# Altium schematic sheet PORT.SchDoc
size A4; SheetNumber: 5; SheetTotal: 5
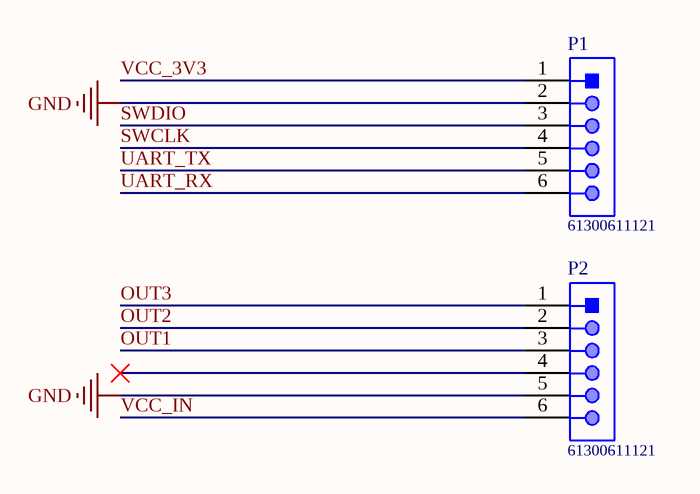
[diagram p0: PORT.SchDoc]

## Parts
P1  61300611121  [61300611121]
P2  61300611121  [61300611121]

## Nets
GND: P1.2 P2.5
OUT1: P2.3
OUT2: P2.2
OUT3: P2.1
SWCLK: P1.4
SWDIO: P1.3
UART_RX: P1.6
UART_TX: P1.5
VCC_3V3: P1.1
VCC_IN: P2.6

Not connected (* = marked no-connect by the designer): P2 4*

## Library data of the parts
P1 P2 = CMP-1502-01070-1: THT Vertical Pin Header WR-PHD, Pitch 2.54 mm, Single Row, 6 pins; Manufacturer: Wurth Elektronik; Gender: Male; Pin Number: 6; Pitch: 2.54mm; Working Voltage: 250VAC; Rated Current: 3A; Withstanding Voltage: 500VAC; Contact Resistance: 20mOhm; Operating Temperature: -40to105degC; Packaging: Bag; Datasheet URL: https://katalog.we-online.de/em/datasheet/6130xx11121.pdf; Package Reference: 61300611121; Mounting Technology: THT; Publisher: WurthElektronik; Part Number: 61300611121; Manufacturer URL: http://www.we-online.de; Row Number: Single; Orientation: Vertical